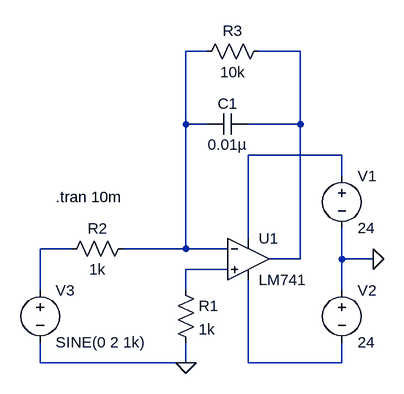
[diagram p0: schematic 10-int.asc]
10-int.asc, the LTspice schematic file:
Version 4.1
SHEET 1 880 680
WIRE 160 -160 128 -160
WIRE 304 -160 240 -160
WIRE 128 -48 128 -160
WIRE 160 -48 128 -48
WIRE 304 -48 304 -160
WIRE 304 -48 224 -48
WIRE 368 0 224 0
WIRE 368 32 368 0
WIRE 224 128 224 0
WIRE -48 144 -96 144
WIRE 128 144 128 -48
WIRE 128 144 32 144
WIRE 192 144 128 144
WIRE 304 160 304 -48
WIRE 304 160 256 160
WIRE 368 160 368 112
WIRE 416 160 368 160
WIRE 192 176 128 176
WIRE -96 208 -96 144
WIRE 128 208 128 176
WIRE 368 208 368 160
WIRE -96 320 -96 288
WIRE 128 320 128 288
WIRE 128 320 -96 320
WIRE 224 320 224 192
WIRE 368 320 368 288
WIRE 368 320 224 320
FLAG 416 160 0
FLAG 128 320 0
SYMBOL LM741 224 96 R0
SYMATTR InstName U1
SYMBOL voltage 368 16 R0
SYMATTR InstName V1
SYMATTR Value 24
SYMBOL voltage 368 192 R0
SYMATTR InstName V2
SYMATTR Value 24
SYMBOL res 112 192 R0
SYMATTR InstName R1
SYMATTR Value 1k
SYMBOL voltage -96 192 R0
WINDOW 123 0 0 Left 0
WINDOW 39 0 0 Left 0
SYMATTR InstName V3
SYMATTR Value SINE(0 2 1k)
SYMBOL res 48 128 R90
WINDOW 0 0 56 VBottom 2
WINDOW 3 32 56 VTop 2
SYMATTR InstName R2
SYMATTR Value 1k
SYMBOL cap 224 -64 R90
WINDOW 0 0 32 VBottom 2
WINDOW 3 32 32 VTop 2
SYMATTR InstName C1
SYMATTR Value 0.01µ
SYMBOL res 256 -176 R90
WINDOW 0 0 56 VBottom 2
WINDOW 3 32 56 VTop 2
SYMATTR InstName R3
SYMATTR Value 10k
TEXT -72 64 Left 2 !.tran 10m

The netlist it stands for:
* 10-int.asc
X§U1 N005 N001 N003 N006 N002 LM741  ; pins In+ In- V+ V- OUT
V1 N003 0 24
V2 0 N006 24
R1 N005 0 1k
V3 N004 0 SINE(0 2 1k)
R2 N001 N004 1k
C1 N002 N001 0.01µ
R3 N002 N001 10k
.tran 10m
.lib LM741.lib
.backanno
.end